# EAGLE design board_1 (EAGLE 6.1)

## Sheet 1 of 2
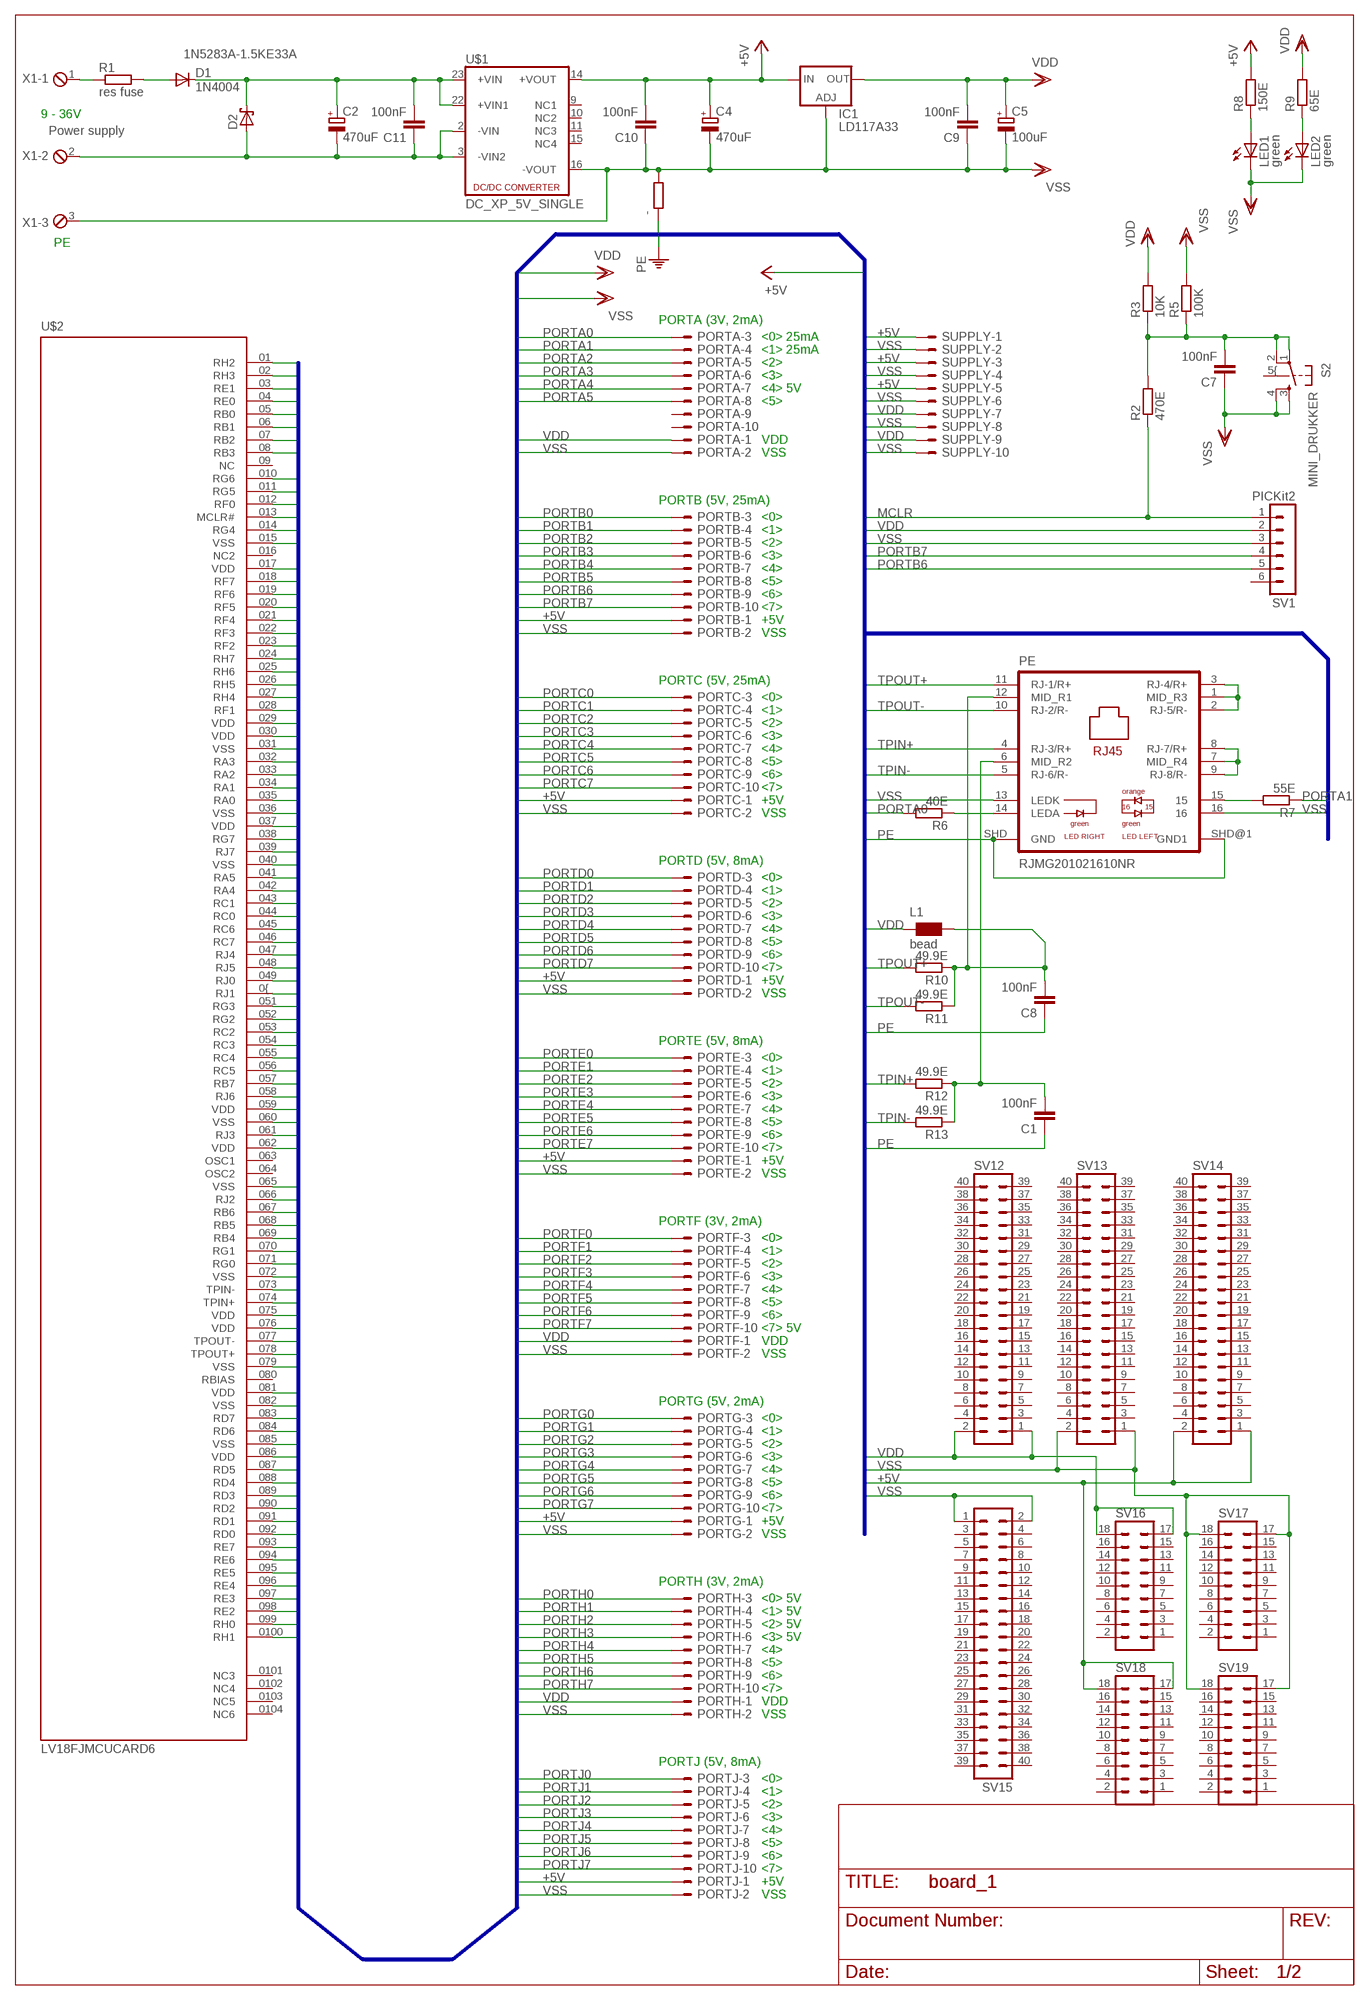
[diagram p0: schematic, sheet 1]

### Parts
-  R-EU_0204/2V  [0204V]
C1  100nF  C-EU050-025X075  [C050-025X075]
C2  470uF  CPOL-EUE5-8.5  [E5-8,5]
C4  470uF  CPOL-EUE5-8.5  [E5-8,5]
C5  100uF  CPOL-EUE5-8.5  [E5-8,5]
C7  100nF  C-EU050-025X075  [C050-025X075]
C8  100nF  C-EU050-025X075  [C050-025X075]
C9  100nF  C-EU050-025X075  [C050-025X075]
C10  100nF  C-EU050-025X075  [C050-025X075]
C11  100nF  C-EU050-025X075  [C050-025X075]
D1  1N4004  [DO41-10]
D2  1N5283A-1.5KE33A  TSD15  [CB429-15]
IC1  LD117A33  [TO220L1_2]
L1  bead  WE-MI_1206  [1206]
LED1  green  LED3MM  [LED3MM]
LED2  green  LED3MM  [LED3MM]
PE  RJMG201021610NR  [RJMG20102XX10XX]
PORTA  ML10E  [ML10]
PORTB  ML10E  [ML10]
PORTC  ML10E  [ML10]
PORTD  ML10E  [ML10]
PORTE  ML10E  [ML10]
PORTF  ML10E  [ML10]
PORTG  ML10E  [ML10]
PORTH  ML10E  [ML10]
PORTJ  ML10E  [ML10]
R1  res fuse  R-EU_0207/7  [0207/7]
R2  470E  R-EU_0207/10  [0207/10]
R3  10K  R-EU_0207/10  [0207/10]
R5  100K  R-EU_0207/10  [0207/10]
R6  40E  R-EU_0207/10  [0207/10]
R7  55E  R-EU_0207/10  [0207/10]
R8  150E  R-EU_0207/10  [0207/10]
R9  65E  R-EU_0207/10  [0207/10]
R10  49.9E  R-EU_0207/10  [0207/10]
R11  49.9E  R-EU_0207/10  [0207/10]
R12  49.9E  R-EU_0207/10  [0207/10]
R13  49.9E  R-EU_0207/10  [0207/10]
S2  MINI_DRUKKER  [MINI_DRUKKER]
SUPPLY  ML10E  [ML10]
SV1  PICKit2  MA06-1  [MA06-1]
SV12  MA20-2  [MA20-2]
SV13  MA20-2  [MA20-2]
SV14  MA20-2  [MA20-2]
SV15  MA20-2  [MA20-2]
SV16  MA09-2  [MA09-2]
SV17  MA09-2  [MA09-2]
SV18  MA09-2  [MA09-2]
SV19  MA09-2  [MA09-2]
U$1  DC_XP_5V_SINGLE  [XP_24P_DIP_5V_SINGLE]
U$2  LV18FJMCUCARD6  [LV18FJMCUCARD6]
X1  Power supply  MPT3  [3POL254]

### Nets
+5V [Power 5V +]: C4.+ C10.2 IC1.3(IN) PORTB.1 PORTC.1 PORTD.1 PORTE.1 PORTG.1 PORTJ.1 R8.2 SUPPLY.1 SUPPLY.3 SUPPLY.5 SV14.1 SV14.2 SV18.17 SV18.18 U$1.14(+VOUT)
MCLR: R2.1 SV1.1 U$2.013(MCLR#)
N$1 [High Voltage +]: D1.A R1.2
N$2: PE.1(MID_R3) PE.2(RJ-5/R-) PE.3(RJ-4/R+)
N$3 [High Voltage +]: R1.1 X1.1
N$4 [High Voltage +]: C2.+ C11.2 D1.C D2.C U$1.22(+VIN1) U$1.23(+VIN)
N$5: C7.2 R2.2 R3.1 R5.1 S2.1(P) S2.2(P1)
N$6: PE.7(MID_R4) PE.8(RJ-7/R+) PE.9(RJ-8/R-)
N$7 [High Voltage -]: C2.- C11.1 D2.A U$1.2(-VIN) U$1.3(-VIN2) X1.2
N$8: PE.14(LEDA) R6.1
N$9: PE.15 R7.2
N$12: LED1.A R8.1
N$13: LED2.A R9.1
N$14: C8.2 L1.2 PE.12(MID_R1) R10.1 R11.1
N$15: C1.2 PE.6(MID_R2) R12.1 R13.1
PE [High Voltage -]: -.1 C1.1 C8.1 PE.SHD(GND) PE.SHD@1(GND1)
PORTA0: PORTA.3 R6.2 U$2.035(RA0)
PORTA1: PORTA.4 R7.1 U$2.034(RA1)
PORTA2: PORTA.5 U$2.033(RA2)
PORTA3: PORTA.6 U$2.032(RA3)
PORTA4: PORTA.7 U$2.042(RA4)
PORTA5: PORTA.8 U$2.041(RA5)
PORTB0: PORTB.3 U$2.05(RB0)
PORTB1: PORTB.4 U$2.06(RB1)
PORTB2: PORTB.5 U$2.07(RB2)
PORTB3: PORTB.6 U$2.08(RB3)
PORTB4: PORTB.7 U$2.069(RB4)
PORTB5: PORTB.8 U$2.068(RB5)
PORTB6: PORTB.9 SV1.5 U$2.067(RB6)
PORTB7: PORTB.10 SV1.4 U$2.057(RB7)
PORTC0: PORTC.3 U$2.044(RC0)
PORTC1: PORTC.4 U$2.043(RC1)
PORTC2: PORTC.5 U$2.053(RC2)
PORTC3: PORTC.6 U$2.054(RC3)
PORTC4: PORTC.7 U$2.055(RC4)
PORTC5: PORTC.8 U$2.056(RC5)
PORTC6: PORTC.9 U$2.045(RC6)
PORTC7: PORTC.10 U$2.046(RC7)
PORTD0: PORTD.3 U$2.092(RD0)
PORTD1: PORTD.4 U$2.091(RD1)
PORTD2: PORTD.5 U$2.090(RD2)
PORTD3: PORTD.6 U$2.089(RD3)
PORTD4: PORTD.7 U$2.088(RD4)
PORTD5: PORTD.8 U$2.087(RD5)
PORTD6: PORTD.9 U$2.084(RD6)
PORTD7: PORTD.10 U$2.083(RD7)
PORTE0: PORTE.3 U$2.04(RE0)
PORTE1: PORTE.4 U$2.03(RE1)
PORTE2: PORTE.5 U$2.098(RE2)
PORTE3: PORTE.6 U$2.097(RE3)
PORTE4: PORTE.7 U$2.096(RE4)
PORTE5: PORTE.8 U$2.095(RE5)
PORTE6: PORTE.9 U$2.094(RE6)
PORTE7: PORTE.10 U$2.093(RE7)
PORTF0: PORTF.3 U$2.012(RF0)
PORTF1: PORTF.4 U$2.028(RF1)
PORTF2: PORTF.5 U$2.023(RF2)
PORTF3: PORTF.6 U$2.022(RF3)
PORTF4: PORTF.7 U$2.021(RF4)
PORTF5: PORTF.8 U$2.020(RF5)
PORTF6: PORTF.9 U$2.019(RF6)
PORTF7: PORTF.10 U$2.018(RF7)
PORTG0: PORTG.3 U$2.071(RG0)
PORTG1: PORTG.4 U$2.070(RG1)
PORTG2: PORTG.5 U$2.052(RG2)
PORTG3: PORTG.6 U$2.051(RG3)
PORTG4: PORTG.7 U$2.014(RG4)
PORTG5: PORTG.8 U$2.011(RG5)
PORTG6: PORTG.9 U$2.010(RG6)
PORTG7: PORTG.10 U$2.038(RG7)
PORTH0: PORTH.3 U$2.099(RH0)
PORTH1: PORTH.4 U$2.0100(RH1)
PORTH2: PORTH.5 U$2.01(RH2)
PORTH3: PORTH.6 U$2.02(RH3)
PORTH4: PORTH.7 U$2.027(RH4)
PORTH5: PORTH.8 U$2.026(RH5)
PORTH6: PORTH.9 U$2.025(RH6)
PORTH7: PORTH.10 U$2.024(RH7)
PORTJ0: PORTJ.3 U$2.049(RJ0)
PORTJ1: PORTJ.4 U$2.0{(RJ1)
PORTJ2: PORTJ.5 U$2.066(RJ2)
PORTJ3: PORTJ.6 U$2.061(RJ3)
PORTJ4: PORTJ.7 U$2.047(RJ4)
PORTJ5: PORTJ.8 U$2.048(RJ5)
PORTJ6: PORTJ.9 U$2.058(RJ6)
PORTJ7: PORTJ.10 U$2.039(RJ7)
TPIN+: PE.4(RJ-3/R+) R12.2 U$2.074(TPIN+)
TPIN-: PE.5(RJ-6/R-) R13.2 U$2.073(TPIN-)
TPOUT+: PE.11(RJ-1/R+) R10.2 U$2.078(TPOUT+)
TPOUT-: PE.10(RJ-2/R-) R11.2 U$2.077(TPOUT-)
VDD [Power 3V +]: C5.+ C9.2 IC1.2(OUT) L1.1 PORTA.1 PORTF.1 PORTH.1 R3.2 R9.2 SUPPLY.7 SUPPLY.9 SV1.2 SV12.1 SV12.2 SV16.17 SV16.18 U$2.017(VDD) U$2.029(VDD) U$2.030(VDD) U$2.037(VDD) U$2.059(VDD) U$2.062(VDD) U$2.075(VDD) U$2.076(VDD) U$2.081(VDD) U$2.086(VDD)
VSS [Power 0V]: -.2 C4.- C5.- C7.1 C9.1 C10.1 IC1.1(ADJ) LED1.K(C) LED2.K(C) PE.13(LEDK) PE.16 PORTA.2 PORTB.2 PORTC.2 PORTD.2 PORTE.2 PORTF.2 PORTG.2 PORTH.2 PORTJ.2 R5.2 S2.3(S) S2.4(S1) SUPPLY.2 SUPPLY.4 SUPPLY.6 SUPPLY.8 SUPPLY.10 SV1.3 SV13.1 SV13.2 SV15.1 SV15.2 SV17.17 SV17.18 SV19.17 SV19.18 U$1.16(-VOUT) U$2.015(VSS) U$2.031(VSS) U$2.036(VSS) U$2.040(VSS) U$2.060(VSS) U$2.065(VSS) U$2.072(VSS) U$2.079(VSS) U$2.082(VSS) U$2.085(VSS) X1.3
Unconnected: PORTA.9 PORTA.10 S2.5{(SHLD) SV1.6 SV12.3 SV12.4 SV12.5 SV12.6 SV12.7 SV12.8 SV12.9 SV12.10 SV12.11 SV12.12 SV12.13 SV12.14 SV12.15 SV12.16 SV12.17 SV12.18 SV12.19 SV12.20 SV12.21 SV12.22 SV12.23 SV12.24 SV12.25 SV12.26 SV12.27 SV12.28 SV12.29 SV12.30 SV12.31 SV12.32 SV12.33 SV12.34 SV12.35 SV12.36 SV12.37 SV12.38 SV12.39 SV12.40 SV13.3 SV13.4 SV13.5 SV13.6 SV13.7 SV13.8 SV13.9 SV13.10 SV13.11 SV13.12 SV13.13 SV13.14 SV13.15 SV13.16 SV13.17 SV13.18 SV13.19 SV13.20 SV13.21 SV13.22 SV13.23 SV13.24 SV13.25 SV13.26 SV13.27 SV13.28 SV13.29 SV13.30 SV13.31 SV13.32 SV13.33 SV13.34 SV13.35 SV13.36 SV13.37 SV13.38 SV13.39 SV13.40 SV14.3 SV14.4 SV14.5 SV14.6 SV14.7 SV14.8 SV14.9 SV14.10 SV14.11 SV14.12 SV14.13 SV14.14 SV14.15 SV14.16 SV14.17 SV14.18 SV14.19 SV14.20 SV14.21 SV14.22 SV14.23 SV14.24 SV14.25 SV14.26 SV14.27 SV14.28 SV14.29 SV14.30 SV14.31 SV14.32 SV14.33 SV14.34 SV14.35 SV14.36 SV14.37 SV14.38 SV14.39 SV14.40 SV15.3 SV15.4 SV15.5 SV15.6 SV15.7 SV15.8 SV15.9 SV15.10 SV15.11 SV15.12 SV15.13 SV15.14 SV15.15 SV15.16 SV15.17 SV15.18 SV15.19 SV15.20 SV15.21 SV15.22 SV15.23 SV15.24 SV15.25 SV15.26 SV15.27 SV15.28 SV15.29 SV15.30 SV15.31 SV15.32 SV15.33 SV15.34 SV15.35 SV15.36 SV15.37 SV15.38 SV15.39 SV15.40 SV16.1 SV16.2 SV16.3 SV16.4 SV16.5 SV16.6 SV16.7 SV16.8 SV16.9 SV16.10 SV16.11 SV16.12 SV16.13 SV16.14 SV16.15 SV16.16 SV17.1 SV17.2 SV17.3 SV17.4 SV17.5 SV17.6 SV17.7 SV17.8 SV17.9 SV17.10 SV17.11 SV17.12 SV17.13 SV17.14 SV17.15 SV17.16 SV18.1 SV18.2 SV18.3 SV18.4 SV18.5 SV18.6 SV18.7 SV18.8 SV18.9 SV18.10 SV18.11 SV18.12 SV18.13 SV18.14 SV18.15 SV18.16 SV19.1 SV19.2 SV19.3 SV19.4 SV19.5 SV19.6 SV19.7 SV19.8 SV19.9 SV19.10 SV19.11 SV19.12 SV19.13 SV19.14 SV19.15 SV19.16 U$1.9(NC1) U$1.10(NC2) U$1.11(NC3) U$1.15(NC4) U$2.09(NC) U$2.016(NC2) U$2.063(OSC1) U$2.064(OSC2) U$2.080(RBIAS) U$2.0101(NC3) U$2.0102(NC4) U$2.0103(NC5) U$2.0104(NC6)

### Buses
PORTA[0..7],PORTB[0..7],PORTC[0..7],PORTD[0..7],PORTE[0..7],PORTF[0..7],PORTG[0..7],PORTH[0..7],PORTJ[0..7],TPIN+,TPIN-,TPOUT-,TPOUT+,VDD,VSS,MCLR,+5V,PE

### Notes on the sheet
- 9 - 36V
- PE
- PORTA (3V, 2mA)
- <0> 25mA
- <1> 25mA
- <2>
- <3>
- <4> 5V
- <5>
- VDD
- VSS
- PORTB (5V, 25mA)
- <0>
- <1>
- <2>
- <3>
- <4>
- <5>
- <6>
- <7>
- +5V
- VSS
- PORTC (5V, 25mA)
- <0>
- <1>
- <2>
- <3>
- <4>
- <5>
- <6>
- <7>
- +5V
- VSS
- PORTD (5V, 8mA)
- <0>
- <1>
- <2>
- <3>
- <4>
- <5>
- <6>
- <7>
- +5V
- VSS
- PORTE (5V, 8mA)
- <0>
- <1>
- <2>
- <3>
- <4>
- <5>
- <6>
- <7>
- +5V
- VSS
- PORTF (3V, 2mA)
- <0>
- <1>
- <2>
- <3>
- <4>
- <5>
- <6>
- <7> 5V
- VDD
- VSS
- PORTG (5V, 2mA)
- <0>
- <1>
- <2>
- <3>
- <4>
- <5>
- <6>
- <7>
- +5V
- VSS
- PORTH (3V, 2mA)
- <0> 5V
- <1> 5V
- <2> 5V
- <3> 5V
- <4>
- <5>
- <6>
- <7>
- VDD
- VSS
- PORTJ (5V, 8mA)
- <0>
- <1>
- <2>
- <3>
- <4>
- <5>
- <6>
- <7>
- +5V
- VSS

## Sheet 2 of 2
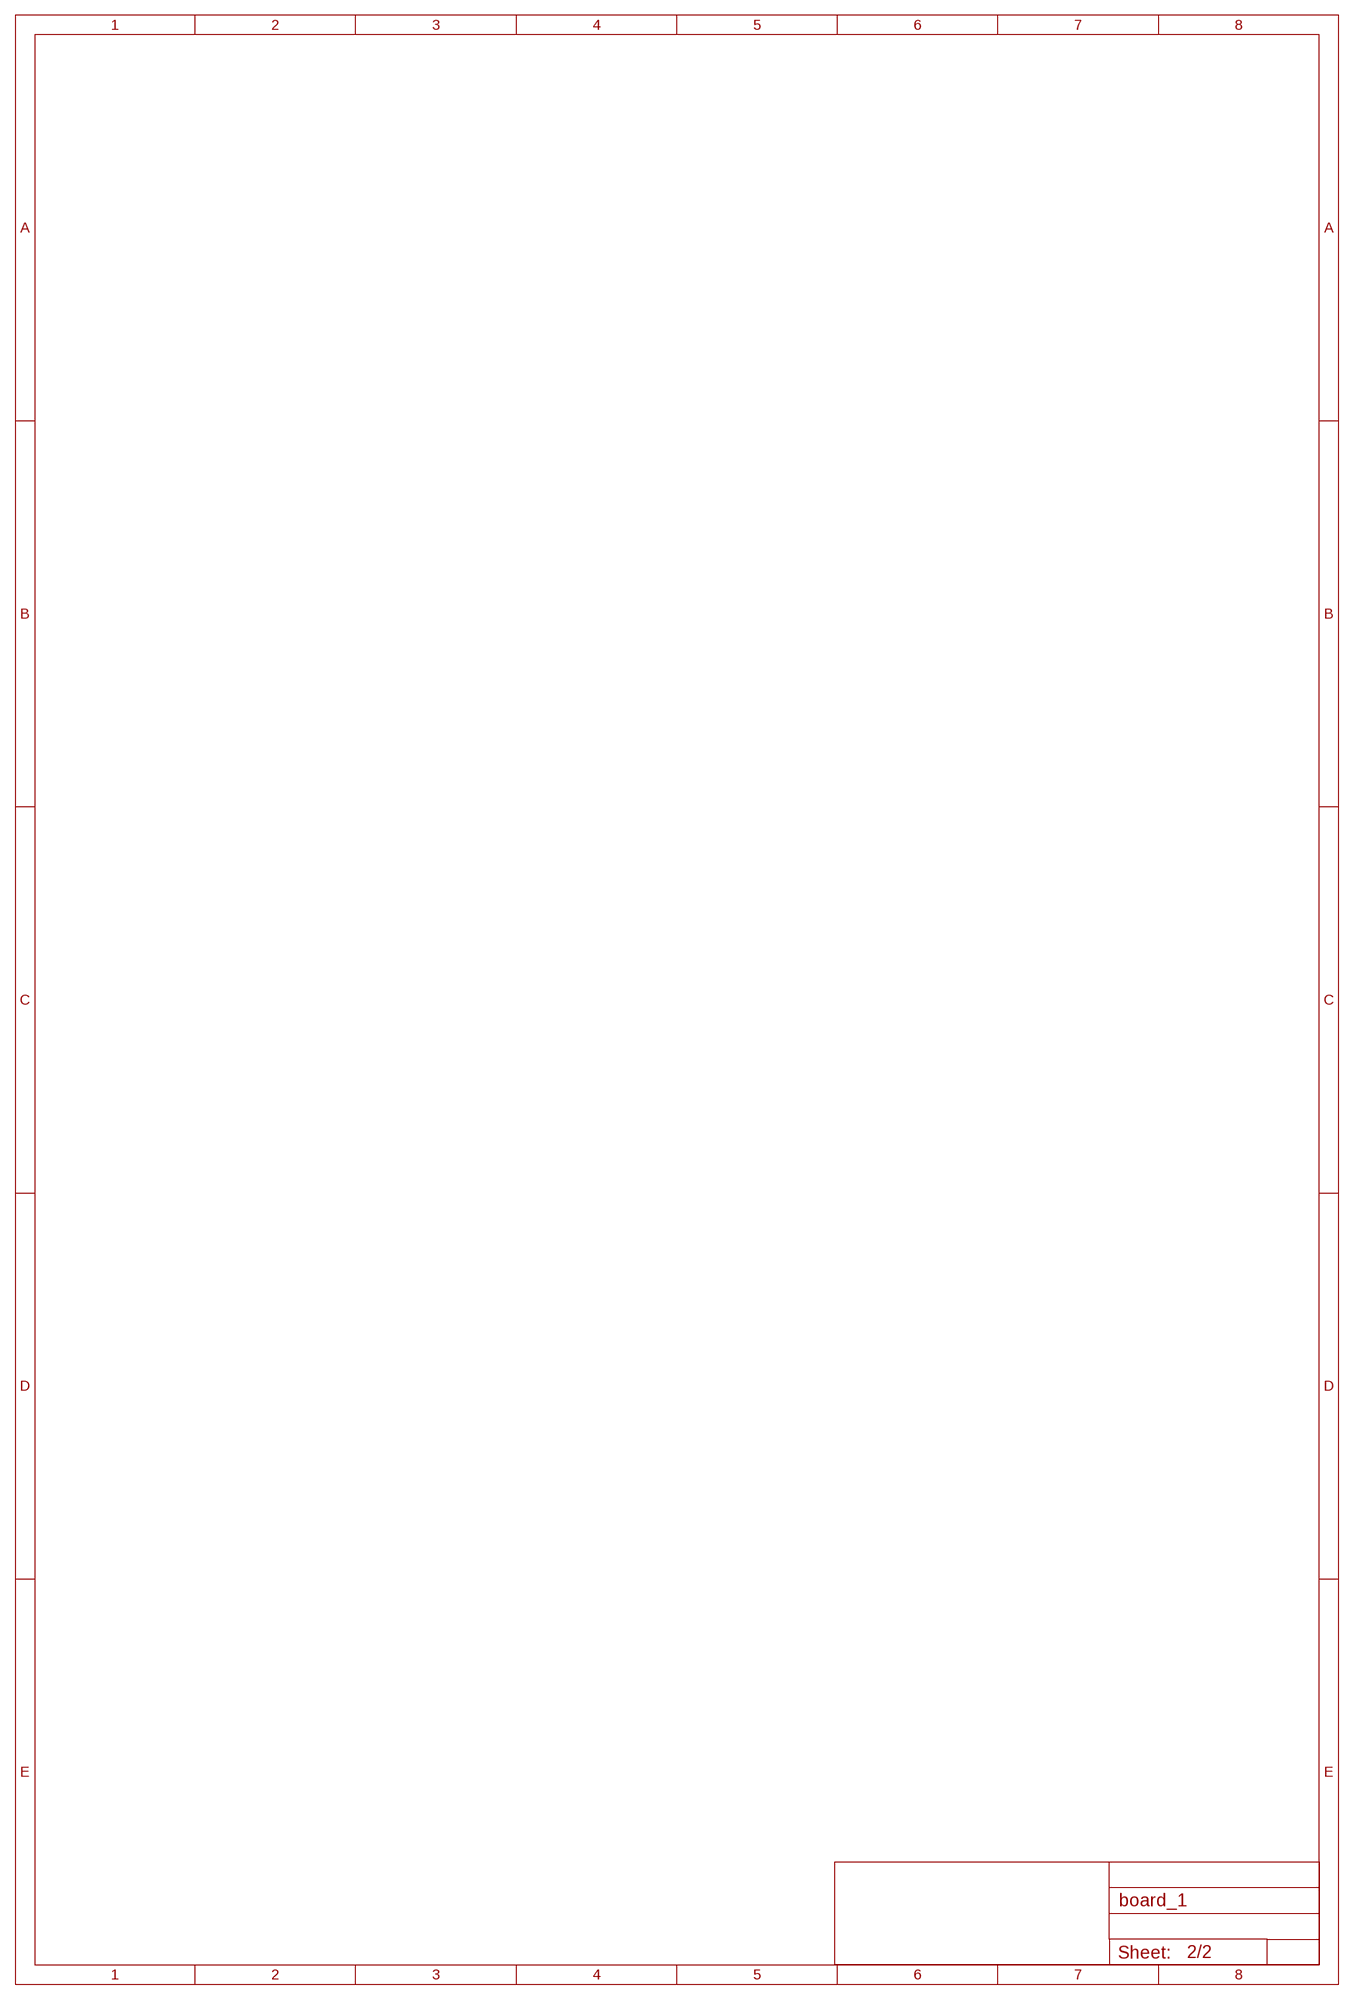
[diagram p1: schematic, sheet 2]

## Library data of the parts
- R1-R3 R5-R13 = rcl:R-EU_: RESISTOR, European symbol
C1 C7-C11 = rcl:C-EU: CAPACITOR, European symbol
C2 C4 C5 = rcl:CPOL-EU: POLARIZED CAPACITOR, European symbol
D1 = diode:1N4004: DIODE general purpose rectifier, 1 A
D2 = diode:TSD15: DIODE
IC1 = v-reg:LD117A?*: Low drop fixed and adjustable positive voltage regulators 1 A Source: http://www.st.com/stonline/products/literature/ds/7194/ld1117axx.pdf
L1 = wuerth-elektronik:WE-MI: SMD Multilayer Inductor WE-MI - Excellent solderability and high heat resistance -- Filter switches -- Oscillators -- Adjustment networks -- Discretely built T- or Pi-Filter
LED1 LED2 = led:LED: LED OSRAM: - CHIPLED LG R971, LG N971, LY N971, LG Q971, LY Q971, LO R971, LY R971 LH N974, LH R974 LS Q976, LO Q976, LY Q976 LO Q996 - Hyper CHIPLED LW Q18S LB Q993, LB Q99A, LB R99A - SideLED LS A670, LO A670, LY A670, LG A670, LP A670 LB A673, LV A673, LT A673, LW A673 LH A674 LY A675 LS A676, LA A676, LO A676, LY A676, LW A676 LS A679, LY A679, LG A679 - Hyper Micro SIDELED® LS Y876, LA Y876, LO Y876, LY Y876 LT Y87S - SmartLED LW L88C, LW L88S LB L89C, LB L89S, LG L890 LS L89K, LO L89K, LY L89K LS L896, LA L896, LO L896, LY L896 - TOPLED LS T670, LO T670, LY T670, LG T670, LP T670 LSG T670, LSP T670, LSY T670, LOP T670, LYG T670 LG T671, LOG T671, LSG T671 LB T673, LV T673, LT T673, LW T673 LH T674 LS T676, LA T676, LO T676, LY T676, LB T676, LH T676, LSB T676, LW T676 LB T67C, LV T67C, LT T67C, LS T67K, LO T67K, LY T67K, LW E67C LS E67B, LA E67B, LO E67B, LY E67B, LB E67C, LV E67C, LT E67C LW T67C LS T679, LY T679, LG T679 LS T770, LO T770, LY T770, LG T770, LP T770 LB T773, LV T773, LT T773, LW T773 LH T774 LS E675, LA E675, LY E675, LS T675 LS T776, LA T776, LO T776, LY T776, LB T776 LHGB T686 LT T68C, LB T68C - Hyper Mini TOPLED® LB M676 - Mini TOPLED Santana® LG M470 LS M47K, LO M47K, LY M47K Source: http://www.osram.convergy.de LUXEON: - LUMILED® LXK2-PW12-R00, LXK2-PW12-S00, LXK2-PW14-U00, LXK2-PW14-V00 LXK2-PM12-R00, LXK2-PM12-S00, LXK2-PM14-U00 LXK2-PE12-Q00, LXK2-PE12-R00, LXK2-PE12-S00, LXK2-PE14-T00, LXK2-PE14-U00 LXK2-PB12-K00, LXK2-PB12-L00, LXK2-PB12-M00, LXK2-PB14-N00, LXK2-PB14-P00, LXK2-PB14-Q00 LXK2-PR12-L00, LXK2-PR12-M00, LXK2-PR14-Q00, LXK2-PR14-R00 LXK2-PD12-Q00, LXK2-PD12-R00, LXK2-PD12-S00 LXK2-PH12-R00, LXK2-PH12-S00 LXK2-PL12-P00, LXK2-PL12-Q00, LXK2-PL12-R00 Source: www.luxeon.com KINGBRIGHT: KA-3528ASYC Source: www.kingbright.com
PE = Custom components:RJMG201021610NR
PORTA PORTB PORTC PORTD PORTE PORTF PORTG PORTH PORTJ SUPPLY = con-ml:ML10E: HARTING
S2 = Custom components:MINI_DRUKKER
SV1 = con-lstb:MA06-1: PIN HEADER
SV12-SV15 = con-lstb:MA20-2: PIN HEADER
SV16-SV19 = con-lstb:MA09-2: PIN HEADER
U$1 = dc-dc-converter:DC_XP_5V_SINGLE
U$2 = Mikroe:LV18FJMCUCARD6
X1 = con-phoenix-254:MPT3: PHOENIX CONNECTOR

## Net classes
1 Power 5V +: width 0.813 mm, drill 0.381 mm, clearance 0.406 mm
2 High Voltage +: width 0.813 mm, drill 0.635 mm, clearance 0.406 mm
3 Digital: width 0.254 mm, drill 0.508 mm, clearance 0.406 mm
4 Power 0V: width 0.813 mm, drill 0.381 mm, clearance 0.406 mm
5 High Voltage -: width 0.813 mm, drill 0.635 mm, clearance 0.406 mm
6 Power 3V +: width 0.813 mm, drill 0.61 mm, clearance 0.406 mm

## Board
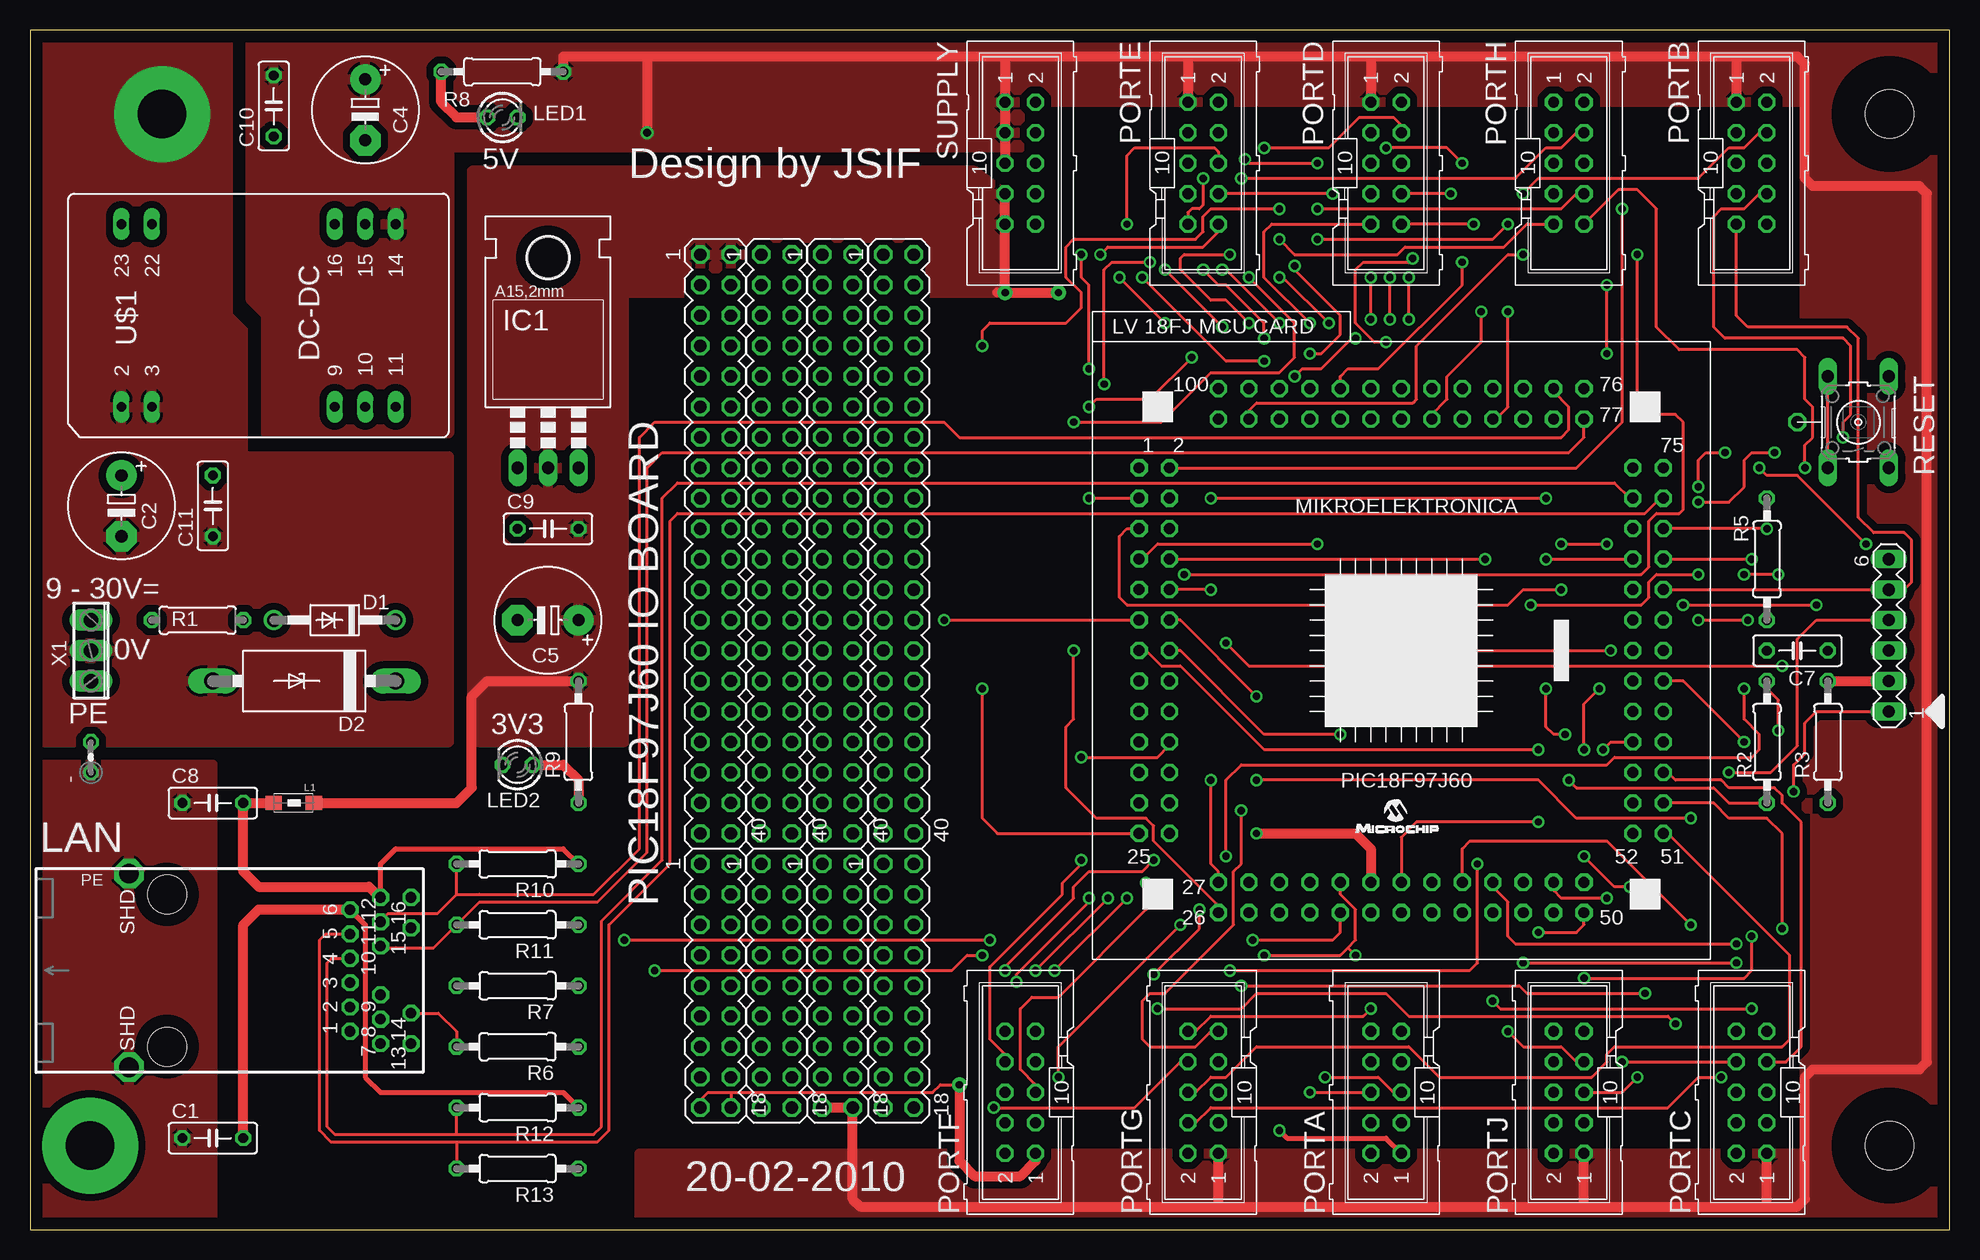
[diagram p2: board, top side]
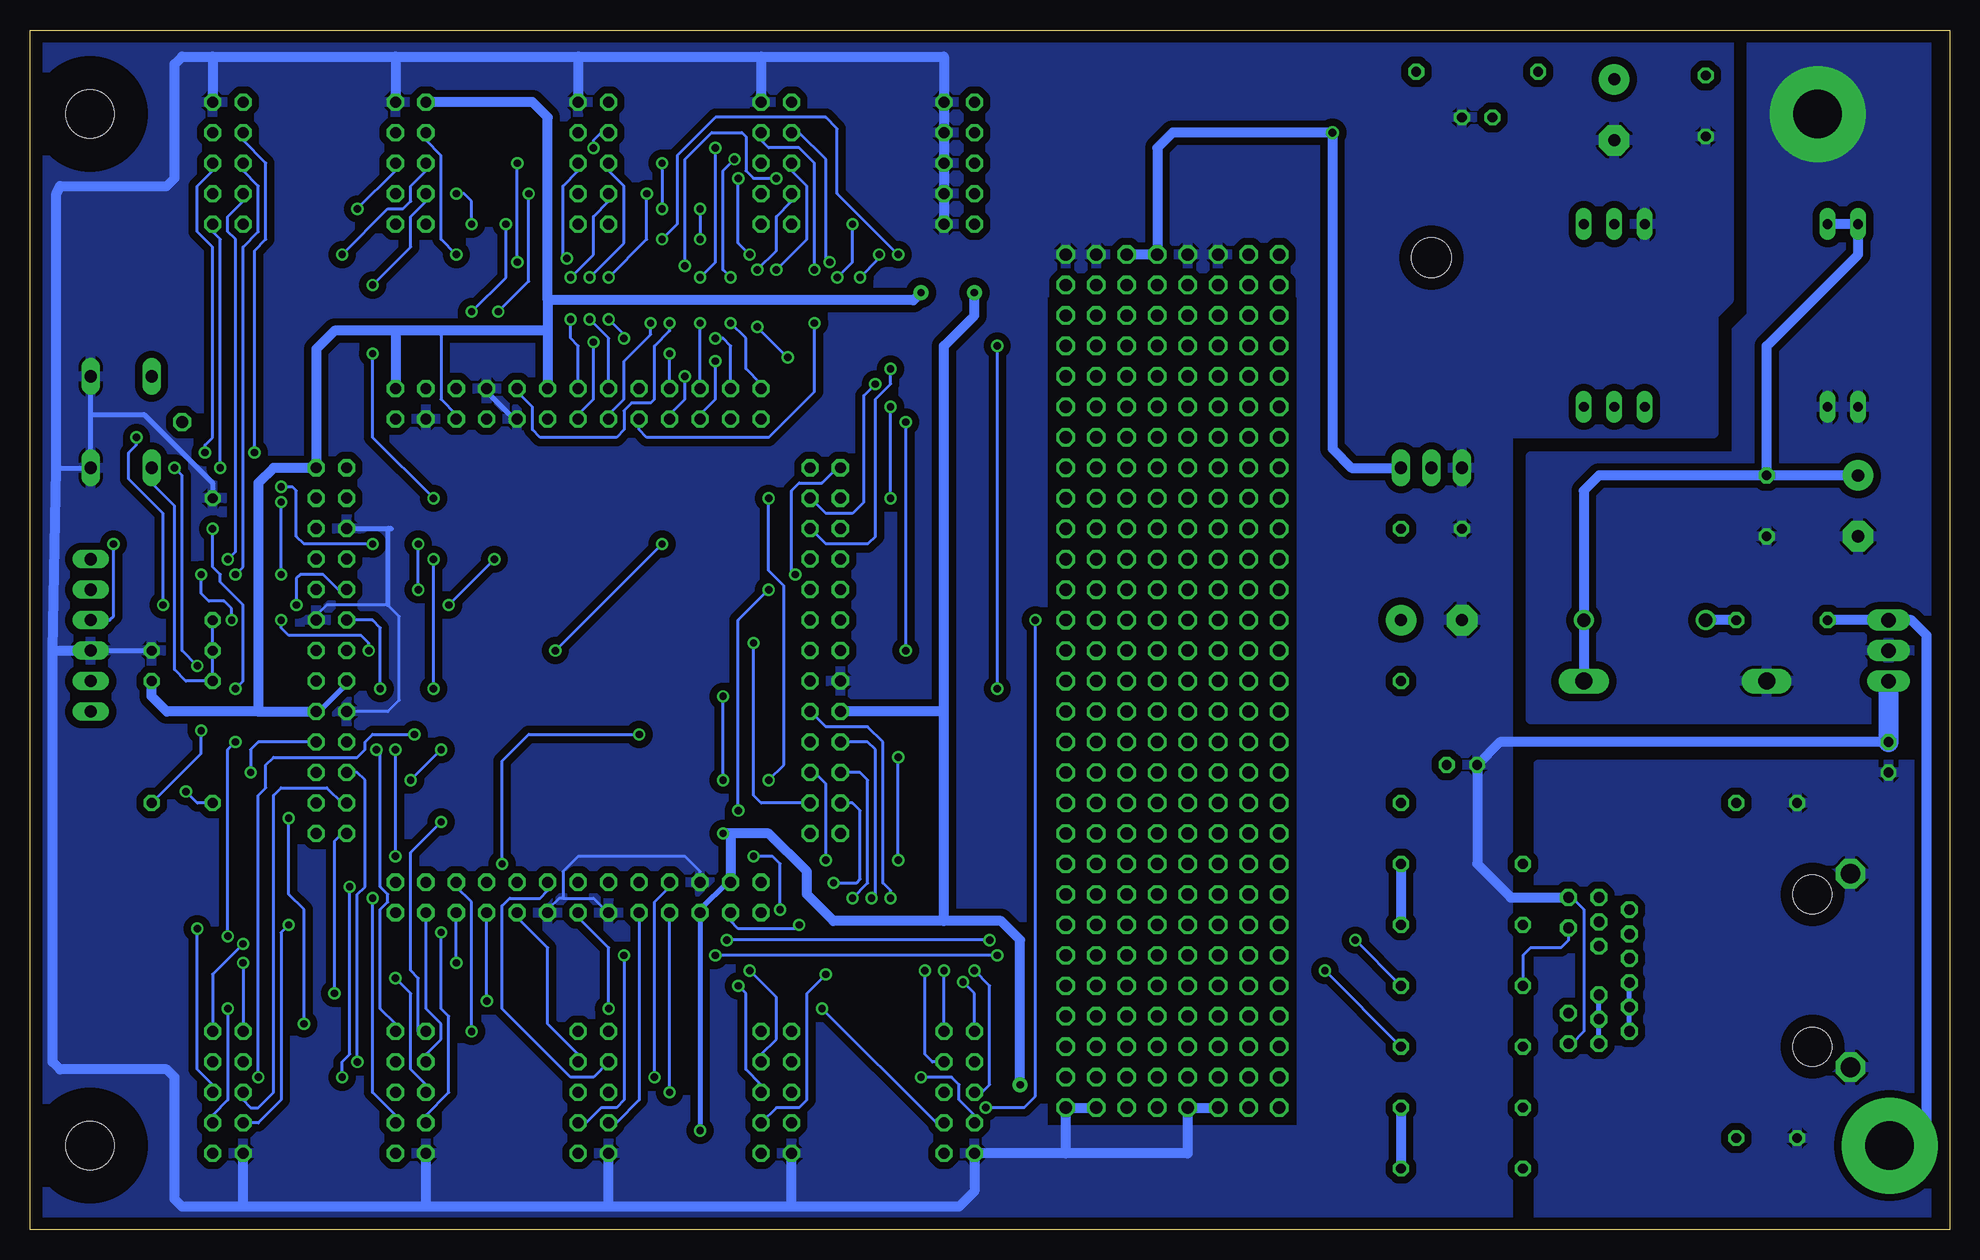
[diagram p3: board, bottom side, seen from below]

Size 160 x 100 mm. Coordinates in mm from the lower left corner, seen from the top.
Outline: 0,0 160,0 160,100 0,100 0,0
Copper layers (1*16): Top 0.035mm / dielectric 1.5mm / Bottom 0.035mm
Design rules: minimum track width 10mil, minimum drill 24mil, track to track 8mil, track to pad 8mil, pad to pad 8mil, via to via 8mil, smd to smd 8mil, copper to edge 40mil, drill to drill 8mil, minimum pad ring 10mil, minimum via ring 8mil, stop-mask expansion 4mil, vias tented up to drill 0mil, thermal gap 10mil
Holes 4.06 mm at 155,93 155,7
tRestrict: area 151,89 to 159,97; area 151,3 to 159,11
bRestrict: area 151,89 to 159,97; area 151,3 to 159,11

### Footprints (pad centres in the part's own frame; a part is rotated, then mirrored left to right if it is on the bottom)
0204V = drill 0.813 octagon: 1 -1.27,0; 2 1.27,0
C050-025X075 = drill 0.813 octagon: 1 -2.54,0; 2 2.54,0
E5-8,5 = drill 1.016 pad 2.54: + -2.54,0 | drill 1.016 pad 2.54 octagon: - 2.54,0
DO41-10 = drill 1.118: A 5.08,0; C -5.08,0
CB429-15 = drill 1.397 long: A 7.62,0; C -7.62,0
TO220L1_2 = drill 1.016 long: 1 -2.54,-6.35; 2 0,-6.35; 3 2.54,-6.35 | hole 3.302: 0,11.176
1206 = smd 1.35 x 1.2: 1 -1.7,0; 2 1.65,0
LED3MM = drill 0.813 octagon: A -1.27,0; K 1.27,0
RJMG20102XX10XX = drill 0.89 octagon: 1 -5.075,-15.25; 2 -3.045,-15.25; 3 -1.015,-15.25; 4 1.015,-15.25; 5 3.045,-15.25; 6 5.075,-15.25; 7 -6.09,-17.79; 8 -4.06,-17.79; 9 -2.03,-17.79; 10 2.03,-17.79; 11 4.06,-17.79; 12 6.09,-17.79; 13 -6.09,-20.33; 14 -3.55,-20.33; 15 3.55,-20.33; 16 6.09,-20.33 | drill 1.64 octagon: SHD -8.065,3.17; SHD@1 8.065,3.17 | hole 3.25: -6.35,0; 6.35,0
ML10 = drill 0.914 octagon: 1 -5.08,-1.27; 2 -5.08,1.27; 3 -2.54,-1.27; 4 -2.54,1.27; 5 0,-1.27; 6 0,1.27; 7 2.54,-1.27; 8 2.54,1.27; 9 5.08,-1.27; 10 5.08,1.27
0207/7 = drill 0.813 octagon: 1 -3.81,0; 2 3.81,0
0207/10 = drill 0.813 octagon: 1 -5.08,0; 2 5.08,0
MINI_DRUKKER = drill 1.016 long: 1 -3.81,2.54; 2 3.81,2.54; 3 -3.81,-2.54; 4 3.81,-2.54 | drill 1.016 octagon: 5{ 0,5.08
MA06-1 = drill 1.016 long: 1 -6.35,0; 2 -3.81,0; 3 -1.27,0; 4 1.27,0; 5 3.81,0; 6 6.35,0
MA20-2 = drill 1.016 octagon: 1 -24.13,-1.27; 2 -24.13,1.27; 3 -21.59,-1.27; 4 -21.59,1.27; 5 -19.05,-1.27; 6 -19.05,1.27; 7 -16.51,-1.27; 8 -16.51,1.27; 9 -13.97,-1.27; 10 -13.97,1.27; 11 -11.43,-1.27; 12 -11.43,1.27; 13 -8.89,-1.27; 14 -8.89,1.27; 15 -6.35,-1.27; 16 -6.35,1.27; 17 -3.81,-1.27; 18 -3.81,1.27; 19 -1.27,-1.27; 20 -1.27,1.27; 21 1.27,-1.27; 22 1.27,1.27; 23 3.81,-1.27; 24 3.81,1.27; 25 6.35,-1.27; 26 6.35,1.27; 27 8.89,-1.27; 28 8.89,1.27; 29 11.43,-1.27; 30 11.43,1.27; 31 13.97,-1.27; 32 13.97,1.27; 33 16.51,-1.27; 34 16.51,1.27; 35 19.05,-1.27; 36 19.05,1.27; 37 21.59,-1.27; 38 21.59,1.27; 39 24.13,-1.27; 40 24.13,1.27
MA09-2 = drill 1.016 octagon: 1 -10.16,-1.27; 2 -10.16,1.27; 3 -7.62,-1.27; 4 -7.62,1.27; 5 -5.08,-1.27; 6 -5.08,1.27; 7 -2.54,-1.27; 8 -2.54,1.27; 9 0,-1.27; 10 0,1.27; 11 2.54,-1.27; 12 2.54,1.27; 13 5.08,-1.27; 14 5.08,1.27; 15 7.62,-1.27; 16 7.62,1.27; 17 10.16,-1.27; 18 10.16,1.27
XP_24P_DIP_5V_SINGLE = drill 0.813 long: 2 -7.62,11.43; 3 -7.62,8.89; 9 -7.62,-6.35; 10 -7.62,-8.89; 11 -7.62,-11.43; 14 7.62,-11.43; 15 7.62,-8.89; 16 7.62,-6.35; 22 7.62,8.89; 23 7.62,11.43
LV18FJMCUCARD6 = drill 0.914 octagon: 0{ 15.24,-21.844; 01 -21.844,15.24; 02 -19.304,15.24; 03 -21.844,12.7; 04 -19.304,12.7; 05 -21.844,10.16; 06 -19.304,10.16; 07 -21.844,7.62; 08 -19.304,7.62; 09 -21.844,5.08; 010 -19.304,5.08; 011 -21.844,2.54; 012 -19.304,2.54; 013 -21.844,0; 014 -19.304,0; 015 -21.844,-2.54; 016 -19.304,-2.54; 017 -21.844,-5.08; 018 -19.304,-5.08; 019 -21.844,-7.62; 020 -19.304,-7.62; 021 -21.844,-10.16; 022 -19.304,-10.16; 023 -21.844,-12.7; 024 -19.304,-12.7; 025 -21.844,-15.24; 026 -15.24,-21.844; 027 -15.24,-19.304; 028 -12.7,-21.844; 029 -12.7,-19.304; 030 -10.16,-21.844; 031 -10.16,-19.304; 032 -7.62,-21.844; 033 -7.62,-19.304; 034 -5.08,-21.844; 035 -5.08,-19.304; 036 -2.54,-21.844; 037 -2.54,-19.304; 038 0,-21.844; 039 0,-19.304; 040 2.54,-21.844; 041 2.54,-19.304; 042 5.08,-21.844; 043 5.08,-19.304; 044 7.62,-21.844; 045 7.62,-19.304; 046 10.16,-21.844; 047 10.16,-19.304; 048 12.7,-21.844; 049 12.7,-19.304; 051 21.844,-15.24; 052 19.304,-15.24; 053 21.844,-12.7; 054 19.304,-12.7; 055 21.844,-10.16; 056 19.304,-10.16; 057 21.844,-7.62; 058 19.304,-7.62; 059 21.844,-5.08; 060 19.304,-5.08; 061 21.844,-2.54; 062 19.304,-2.54; 063 21.844,0; 064 19.304,0; 065 21.844,2.54; 066 19.304,2.54; 067 21.844,5.08; 068 19.304,5.08; 069 21.844,7.62; 070 19.304,7.62; 071 21.844,10.16; 072 19.304,10.16; 073 21.844,12.7; 074 19.304,12.7; 075 21.844,15.24; 076 15.24,21.844; 077 15.24,19.304; 078 12.7,21.844; 079 12.7,19.304; 080 10.16,21.844; 081 10.16,19.304; 082 7.62,21.844; 083 7.62,19.304; 084 5.08,21.844; 085 5.08,19.304; 086 2.54,21.844; 087 2.54,19.304; 088 0,21.844; 089 0,19.304; 090 -2.54,21.844; 091 -2.54,19.304; 092 -5.08,21.844; 093 -5.08,19.304; 094 -7.62,21.844; 095 -7.62,19.304; 096 -10.16,21.844; 097 -10.16,19.304; 098 -12.7,21.844; 099 -12.7,19.304; 0100 -15.24,21.844; 0101 -19.304,-15.24; 0102 15.24,-19.304; 0103 19.304,15.24; 0104 -15.24,19.304
3POL254 = drill 1.2 long: 1 -2.54,0; 2 0,0; 3 2.54,0

### Placement (x,y rotation side)
-  5.08,39.37 90 top
C1  15.24,7.62 0 top
C2  7.62,60.33 270 top
C4  27.94,93.34 270 top
C5  43.18,50.8 180 top
C7  147.32,48.26 180 top
C8  15.24,35.56 0 top
C9  43.18,58.42 0 top
C10  20.32,93.66 90 top
C11  15.24,60.33 90 top
D1  25.4,50.8 180 top
D2  22.86,45.72 180 top
IC1  43.18,69.85 0 top
L1  21.97,35.56 180 top
LED1  39.37,92.71 0 top
LED2  40.64,38.73 180 top
PE  11.43,21.59 90 top
PORTA  113.03,11.43 90 top
PORTB  143.51,88.9 270 top
PORTC  143.51,11.43 90 top
PORTD  113.03,88.9 270 top
PORTE  97.79,88.9 270 top
PORTF  82.55,11.43 90 top
PORTG  97.79,11.43 90 top
PORTH  128.27,88.9 270 top
PORTJ  128.27,11.43 90 top
R1  13.97,50.8 0 top
R2  144.78,40.64 90 top
R3  149.86,40.64 90 top
R5  144.78,55.88 90 top
R6  40.64,15.24 0 top
R7  40.64,20.32 180 top
R8  39.37,96.52 0 top
R9  45.72,40.64 90 top
R10  40.64,30.48 180 top
R11  40.64,25.4 180 top
R12  40.64,10.16 180 top
R13  40.64,5.08 180 top
S2  152.4,67.31 90 top
SUPPLY  82.55,88.9 270 top
SV1  154.94,49.53 90 top
SV12  57.15,57.15 270 top
SV13  62.23,57.15 270 top
SV14  67.31,57.15 270 top
SV15  72.39,57.15 270 top
SV16  57.15,20.32 270 top
SV17  62.23,20.32 270 top
SV18  67.31,20.32 270 top
SV19  72.39,20.32 270 top
U$1  19.05,76.2 90 top
U$2  114.3,48.26 0 top
X1  5.08,48.26 270 top

### Tracks (layer width: path | path; a pad name or v marks a point on that pad's centre or on a via)
+5V  (via drill 0.7)
  Top 0.813: 81.28,97.79 51.44,97.79 | 51.44,97.79 44.45,97.79 R8.2 | SUPPLY.5 SUPPLY.3 SUPPLY.1 81.28,97.79 | 96.52,97.79 PORTE.1 | 96.52,97.79 81.28,97.79 | 111.76,97.79 PORTD.1 | 111.76,97.79 96.52,97.79 | 142.24,97.79 111.76,97.79 | 144.78,1.91 147.32,1.91 147.96,2.54 147.96,12.7 148.59,13.34 157.48,13.34 158.12,13.97 158.12,86.36 157.48,87 148.59,87 147.96,87.63 147.96,97.16 147.32,97.79 142.24,97.79 | 144.78,1.91 PORTC.1 | 142.24,97.79 PORTB.1 | 129.54,1.91 PORTJ.1 | 129.54,1.91 144.78,1.91 | 99.06,1.91 PORTG.1 | 99.06,1.91 129.54,1.91 | 51.44,97.79 v51.44,91.44 | SV18.17 SV18.18 68.58,2.54 69.22,1.91 99.06,1.91
  Bottom 0.813: IC1.3 49.85,63.5 51.44,65.09 v51.44,91.44 64.77,91.44 66.04,90.17 SV14.1 SV14.2
  pour Top (isolate 0.61): 18.41,99.69 83.82,99.69 83.82,95.25 82.55,95.25 82.55,90.17 34.92,90.17 34.92,66.36 19.68,66.36 19.68,76.2 18.41,77.47
  pour Top (isolate 0.61): 159.38,99.69 159.38,0.64 50.8,0.64 50.8,6.35 147.96,6.35 147.96,93.98 83.82,93.98 83.82,99.69
MCLR  (via drill 0.61)
  Top 0.254: v125.73,40.01 102.87,40.01 95.89,46.99 94.3,46.99 93.03,48.26 U$2.013 | v128.27,37.47 128.91,36.83 140.34,36.83 141.6,35.56 R2.1 | v147,36.51 147,38.73 147.64,39.37 147.96,39.69 147.96,42.23 148.91,43.18 SV1.1
  Bottom 0.254: v125.73,40.01 v128.27,37.47 | v147,36.51 146.05,35.56 R2.1
N$1
  Bottom 0.813: R1.2 D1.A
N$2
  Bottom 0.406: PE.3 26.68,19.06 26.67,19.05 26.68,19.04 PE.2 PE.1 | PE.1 | PE.1
N$3  (via drill 4.06 pad 8)
  Bottom 0.813: R1.1 X1.1 3.17,50.8 1.91,49.53 1.91,8.89 3.79,7 v5,7
N$4
  Bottom 0.813: U$1.22 U$1.23 7.62,81.28 15.24,73.66 C11.2 | C2.+ C11.2 | C11.2 29.21,62.87 30.48,61.59 D1.C D2.C
N$5  (via drill 0.61)
  Top 0.254: S2.1 S2.2 | v145.73,41.59 145.73,44.13 144.78,45.09 R2.2
  Bottom 0.254: R5.1 C7.2 R2.2 147,45.72 147.96,46.67 147.96,60.33 149.86,62.23 S2.1 | R3.1 145.73,39.69 v145.73,41.59
N$6
  Bottom 0.406: PE.9 29.22,17.79 29.21,17.78 29.22,17.77 PE.8 29.22,15.25 | PE.7 29.22,15.25 | 29.22,15.25 29.21,15.24
N$7  (via drill 4.06 pad 8)
  other vias: 11,93
  pour Bottom (isolate 0.61): 1.91,42.55 1.91,99.69 16.51,99.69 16.51,76.2 17.78,74.93 17.78,64.45 34.92,64.45 34.92,42.55
  pour Top (isolate 0.61): 0.64,99.69 0.64,40.64 34.92,40.64 34.92,64.45 17.78,64.45 17.78,74.93 16.51,76.2 16.51,99.69
N$8
  Top 0.254: PE.14 34.03,18.04 35.56,16.51 R6.1
N$9
  Bottom 0.254: PE.15 31.76,24.12 32.38,23.5 34.92,23.5 35.56,22.86 R7.2
N$12
  Top 0.813: LED1.A 35.56,92.71 34.29,93.98 R8.1
N$13
  Top 0.813: LED2.A 44.45,38.73 45.72,37.47 R9.1
N$14
  Top 0.406: R10.1 44.45,31.75 30.48,31.75 29.21,30.48 29.21,27.94 29.22,27.93 PE.12
  Top 0.813: PE.12 29.22,27.63 29.21,27.62 28.26,28.57 19.05,28.57 17.78,29.84 C8.2 L1.2
  Bottom 0.813: R10.1 R11.1
N$15
  Top 0.406: PE.6 27.94,25.4 27.94,12.7 29.21,11.43 44.45,11.43 R12.1
  Top 0.813: C1.2 17.78,25.4 19.05,26.67 PE.6
  Bottom 0.813: R12.1 R13.1
PE
  pour Bottom (isolate 0.61): 1.91,0.64 1.91,38.73 34.29,38.73 34.29,0.64
  pour Top (isolate 0.61): 0.64,0.64 15.24,0.64 15.24,38.73 0.64,38.73
PORTA0  (via drill 0.61, 0.61 pad 0.61)
  Top 0.254: v102.87,22.86 109.22,22.86 109.86,23.5 | 109.86,23.5 110.49,24.13 110.49,26.67 109.22,27.94 U$2.035 109.22,29.21 | 109.86,23.5 v110.49,22.86 | v52.07,21.59 76.83,21.59 78.11,22.86 v79.38,22.86
  Bottom 0.254: v110.49,22.86 110.49,10.79 111.12,10.16 112.39,10.16 113.67,8.89 PORTA.3 | v79.38,22.86 v102.87,22.86 | R6.2 v52.07,21.59
PORTA1  (via drill 0.61, 0.61 pad 0.61)
  Top 0.254: v49.53,24.13 v80.01,24.13 | v101.92,24.13 108.58,24.13 109.22,24.77 U$2.034
  Bottom 0.254: PORTA.4 111.12,8.89 109.22,10.79 U$2.034 | v80.01,24.13 v101.92,24.13 | R7.1 v49.53,24.13
PORTA2  (via drill 0.61)
  Top 0.254: v107.95,12.7 112.39,12.7 113.67,11.43 PORTA.5
  Bottom 0.254: v107.95,12.7 107.95,27.3 106.68,28.57 U$2.033
PORTA3  (via drill 0.61)
  Top 0.254: v106.68,11.43 PORTA.6
  Bottom 0.254: v106.68,11.43 U$2.032
PORTA4
  Bottom 0.254: U$2.042 119.38,26.04 116.84,23.5 116.84,17.14 114.3,14.61 PORTA.7
PORTA5
  Bottom 0.254: PORTA.8 113.03,12.7 114.94,12.7 120.65,18.41 120.65,26.99 120.02,27.62 117.47,27.62 116.84,28.26 U$2.041
PORTB0  (via drill 0.61)
  Top 0.254: v127.64,53.34 124.46,53.34 123.19,52.07 91.44,52.07 90.81,52.7 90.81,57.78 91.44,58.42 U$2.05 | v127.64,57.15 v131.44,57.15 | v139.06,61.91 139.06,64.14 139.7,64.77 v141.29,64.77
  Bottom 0.254: v127.64,53.34 v127.64,57.15 | v131.44,57.15 137.16,57.15 137.79,57.78 137.79,61.59 138.11,61.91 v139.06,61.91 | v141.29,64.77 141.29,81.6 140.34,82.55 140.34,88.9 142.24,90.81 PORTB.3
PORTB1  (via drill 0.61)
  Top 0.254: v88.27,71.75 88.27,78.74 87.63,79.38 v87.63,81.28 | v107.31,82.55 121.92,82.55 v123.19,83.82 | v124.46,86.36 125.73,87.63 139.06,87.63 141.6,90.17 142.88,90.17 144.15,91.44 PORTB.4
  Bottom 0.254: v88.27,71.75 88.27,70.48 89.53,69.22 89.53,57.78 90.17,57.15 93.66,57.15 94.93,58.42 U$2.06 | v87.63,81.28 92.71,86.36 92.71,91.76 93.66,92.71 102.87,92.71 106.05,89.53 106.05,83.82 v107.31,82.55 | v123.19,83.82 123.19,85.72 123.83,86.36 v124.46,86.36
PORTB2  (via drill 0.61)
  Top 0.254: v107.31,57.15 93.98,57.15 92.71,55.88 U$2.07 | v116.2,48.26 v131.76,48.26 | v139.06,50.8 v143.19,50.8 | v145.73,54.61 v142.88,54.61
  Bottom 0.254: v107.31,57.15 v116.2,48.26 | v131.76,48.26 131.76,48.9 132.4,49.53 138.43,49.53 139.06,50.16 v139.06,50.8 | v143.19,50.8 143.19,51.75 143.83,52.39 145.1,52.39 145.73,53.02 v145.73,54.61 | v142.88,54.61 142.24,55.24 142.24,81.92 140.97,83.19 140.97,87 142.24,88.27 PORTB.5
PORTB3  (via drill 0.61)
  Top 0.254: v125.09,52.07 134.3,52.07 134.94,52.7 134.94,53.98 135.57,54.61 v139.06,54.61 | v139.06,60.64 141.6,60.64 142.88,61.91 142.88,64.14 143.51,64.77 v145.41,64.77 | U$2.08 v121.28,55.88
  Bottom 0.254: v121.28,55.88 v125.09,52.07 | v139.06,54.61 v139.06,60.64 | v145.41,64.77 145.41,65.41 144.78,66.04 144.78,81.92 146.05,83.19 146.05,87 144.78,88.27 PORTB.6
PORTB4  (via drill 0.61)
  Top 0.254: U$2.069 v143.51,55.88
  Bottom 0.254: v143.51,55.88 142.88,56.52 142.88,82.55 143.51,83.19 143.51,84.45 142.24,85.72 PORTB.7
PORTB5  (via drill 0.61)
  Top 0.254: v137.79,52.07 v148.91,52.07 | v151.13,66.04 151.13,67.31 151.76,67.94 151.76,73.66 151.13,74.3 141.29,74.3 140.34,75.25 140.34,84.45 140.97,85.09 142.88,85.09 144.15,86.36 PORTB.8
  Bottom 0.254: v137.79,52.07 137.79,54.29 137.48,54.61 135.57,54.61 134.3,53.34 U$2.068 | v148.91,52.07 148.91,59.69 151.76,62.55 151.76,64.77 151.13,65.41 v151.13,66.04
PORTB6
  Top 0.254: U$2.067 SV1.5 156.21,53.34 156.84,53.98 156.84,57.47 156.21,58.1 153.67,58.1 152.4,59.37 152.4,74.3 151.45,75.25 143.19,75.25 142.24,76.2 PORTB.9
PORTB7  (via drill 0.61)
  Top 0.254: v141.6,38.1 145.1,38.1 147.32,40.32 147.32,49.21 148.91,50.8 SV1.4 | v144.15,63.5 144.78,62.87 147.32,62.87 v153.03,57.15
  Bottom 0.254: v141.6,38.1 141.6,40.01 140.97,40.64 U$2.057 | v144.15,63.5 144.15,82.55 144.78,83.19 PORTB.10 | SV1.4 153.35,50.8 153.03,51.12 v153.03,57.15
PORTC0  (via drill 0.61)
  Top 0.254: v121.92,19.05 122.56,18.41 v143.51,18.41
  Bottom 0.254: v143.51,18.41 143.51,10.79 144.78,9.53 PORTC.3 | v121.92,19.05 U$2.044
PORTC1  (via drill 0.61)
  Top 0.254: v138.43,25.4 131.44,32.38 120.02,32.38 119.38,31.75 U$2.043
  Bottom 0.254: v138.43,25.4 139.06,24.77 139.06,10.79 140.97,8.89 PORTC.4
PORTC2  (via drill 0.61)
  Top 0.254: U$2.053 140.34,35.56 141.6,34.29 144.78,34.29 146.05,33.02 v146.05,25.08
  Bottom 0.254: v146.05,25.08 146.05,13.34 144.78,12.06 PORTC.5
PORTC3
  Bottom 0.254: U$2.054 133.99,35.56 135.25,36.83 139.06,36.83 139.7,36.2 139.7,11.43 140.97,10.16 141.6,10.16 142.24,10.79 PORTC.6
PORTC4
  Top 0.254: U$2.055 136.53,38.1 137.16,37.47 140.97,37.47 141.6,36.83 145.41,36.83 146.05,36.2 146.05,35.56 147.64,33.97 147.64,15.24 146.37,13.97 PORTC.7
PORTC5  (via drill 0.61)
  Top 0.254: v132.72,13.97 PORTC.8
  Bottom 0.254: v132.72,13.97 132.72,27.94 132.08,28.57 132.08,37.47 132.72,38.1 U$2.056
PORTC6  (via drill 0.61)
  Top 0.254: v142.24,23.81 123.83,23.81 123.19,24.45 123.19,27.3 121.92,28.57 U$2.045
  Bottom 0.254: PORTC.9 144.78,21.27 v142.24,23.81
PORTC7  (via drill 0.61)
  Top 0.254: v124.46,22.23 v142.24,22.23
  Bottom 0.254: v124.46,22.23 U$2.046 | v142.24,22.23 PORTC.10
PORTD0  (via drill 0.61)
  Top 0.254: v119.38,80.64 119.38,78.74 112.39,71.75 109.86,71.75 109.22,71.12 U$2.092 | v119.38,88.9 118.11,90.17 v113.03,90.17
  Bottom 0.254: v119.38,80.64 v119.38,88.9 | PORTD.3 112.39,91.44 113.03,90.81 v113.03,90.17
PORTD1  (via drill 0.61)
  Top 0.254: v108.27,75.56 104.46,79.38 v104.14,79.38 | v102.87,90.17 108.27,90.17 110.81,92.71 113.67,92.71 114.3,92.08 PORTD.4
  Bottom 0.254: v108.27,75.56 108.27,74.61 110.49,72.39 110.49,69.22 111.76,67.94 U$2.091 | v104.14,79.38 102.87,80.64 v102.87,90.17
PORTD2  (via drill 0.61)
  Top 0.254: v113.35,75.88 v113.35,79.38
  Bottom 0.254: v113.35,75.88 111.76,74.3 U$2.090 | v113.35,79.38 110.49,82.23 110.49,87 111.76,88.27 PORTD.5
PORTD3  (via drill 0.61)
  Top 0.254: v113.03,73.98 112.08,73.98 110.49,75.56 110.49,80.01 111.12,80.64 114.94,80.64 v115.25,80.96
  Bottom 0.254: v113.03,73.98 113.03,69.22 114.3,67.94 U$2.089 | v115.25,80.96 115.57,81.28 115.57,87 114.3,88.27 PORTD.6
PORTD4  (via drill 0.61)
  Top 0.254: v114.94,75.88 v114.94,79.38
  Bottom 0.254: v114.94,79.38 113.03,81.28 113.03,84.45 111.76,85.72 PORTD.7 | U$2.088 114.3,73.66 114.94,74.3 v114.94,75.88
PORTD5  (via drill 0.61)
  Top 0.254: v118.43,86.36 PORTD.8 | v120.97,76.52 120.97,73.98 118.11,71.12 118.11,69.22 116.84,67.94 U$2.087
  Bottom 0.254: v120.97,76.52 118.43,79.06 v118.43,86.36
PORTD6  (via drill 0.61)
  Top 0.254: v106.68,75.56 102.87,79.38 102.87,83.19 103.5,83.82 PORTD.9
  Bottom 0.254: v106.68,75.56 106.68,74.93 107.95,73.66 107.95,69.22 108.27,68.9 109.86,68.9 110.49,68.26 110.49,66.67 111.12,66.04 117.47,66.04 118.11,66.67 118.11,68.58 119.38,69.85 U$2.084
PORTD7  (via drill 0.61)
  Top 0.254: v120.33,83.82 PORTD.10 | v123.19,76.52 123.19,68.58 121.92,67.31 U$2.083
  Bottom 0.254: v123.19,76.52 120.33,79.38 v120.33,83.82
PORTE0  (via drill 0.61)
  Top 0.254: v89.53,70.48 89.53,80.01 90.17,80.64 v93.34,80.64
  Bottom 0.254: v93.34,80.64 93.66,80.96 93.66,89.22 95.89,91.44 PORTE.3 | v89.53,70.48 90.49,69.53 90.49,60.64 91.44,59.69 93.66,59.69 94.93,60.96 U$2.04
PORTE1  (via drill 0.61)
  Top 0.254: v88.27,68.58 88.9,69.22 93.34,69.22 v96.84,72.71 | v99.38,75.25 v94.61,80.01 | v88.27,60.96 U$2.03
  Bottom 0.254: v88.27,60.96 v88.27,68.58 | v96.84,72.71 v99.38,75.25 | v94.61,80.01 94.61,88.9 95.89,90.17 98.42,90.17 99.06,90.81 PORTE.4
PORTE2  (via drill 0.61)
  Top 0.254: v102.87,74.3 102.87,75.56 99.69,78.74 99.06,78.74 v97.79,80.01
  Bottom 0.254: v97.79,80.01 95.25,82.55 95.25,87 96.52,88.27 PORTE.5 | U$2.098 101.6,73.66 102.23,74.3 v102.87,74.3
PORTE3  (via drill 0.61)
  Top 0.254: v102.87,72.39 99.69,72.39 v92.71,79.38 | v91.44,83.82 91.44,89.53 92.08,90.17 98.74,90.17 99.06,89.85 PORTE.6
  Bottom 0.254: v102.87,72.39 102.87,69.22 104.14,67.94 U$2.097 | v92.71,79.38 91.44,80.64 v91.44,83.82
PORTE4  (via drill 0.61)
  Top 0.254: v104.14,75.56 99.69,80.01 v99.38,80.01
  Bottom 0.254: v99.38,80.01 97.79,81.6 97.79,84.45 96.52,85.72 PORTE.7 | U$2.096 v104.14,75.56
PORTE5  (via drill 0.61)
  Top 0.254: v111.76,75.88 v111.76,79.38 | v108.58,86.36 PORTE.8 | v105.41,71.12 106.05,71.75 107.63,71.75 110.17,74.3 v110.49,74.3
  Bottom 0.254: v105.41,71.12 105.41,69.22 106.68,67.94 U$2.095 | v110.49,74.3 110.49,74.61 v111.76,75.88 | v111.76,79.38 108.58,82.55 v108.58,86.36
PORTE6  (via drill 0.61)
  Top 0.254: v106.68,73.03 107.63,73.03 109.22,74.61 109.22,76.2 105.41,80.01 v105.41,80.33 | v97.79,87.63 97.79,85.41 97.47,85.09 96.84,85.09 96.52,84.77 PORTE.9
  Bottom 0.254: v105.41,80.33 105.41,89.22 103.19,91.44 100.65,91.44 100.33,91.12 100.33,88.27 99.69,87.63 v97.79,87.63 | U$2.094 v106.68,73.03
PORTE7  (via drill 0.61)
  Top 0.254: v94.61,75.56 v90.81,79.38 | v89.22,81.28 89.85,81.92 97.79,81.92 99.06,83.19 PORTE.10
  Bottom 0.254: v94.61,75.56 94.61,69.85 98.42,66.04 108.58,66.04 109.22,66.67 U$2.093 | v90.81,79.38 89.22,80.96 v89.22,81.28
PORTF0  (via drill 0.61)
  Top 0.254: v102.23,37.47 125.73,37.47 128.91,34.29 v138.43,34.29 | v137.16,17.14 136.53,17.78 114.94,17.78 113.03,19.68 102.23,19.68 100.97,18.41 v93.98,18.41 | U$2.012 95.89,50.8 v102.23,44.45
  Bottom 0.254: v102.23,37.47 v102.23,44.45 | v137.16,17.14 137.16,26.67 138.43,27.94 v138.43,34.29 | v93.98,18.41 84.45,8.89 PORTF.3
PORTF1  (via drill 0.61)
  Top 0.254: v95.89,25.4 85.72,15.24 v85.72,12.7
  Bottom 0.254: v95.89,25.4 96.2,25.08 100.97,25.08 101.6,25.72 U$2.028 | v85.72,12.7 83.19,12.7 82.55,12.06 82.55,10.79 81.28,9.53 PORTF.4
PORTF2  (via drill 0.61)
  Top 0.254: PORTF.5 83.82,12.06 82.55,13.34 82.55,18.41 83.5,19.37 85.72,19.37 93.03,26.67 v93.03,28.89
  Bottom 0.254: U$2.023 91.44,35.56 90.81,34.92 90.81,29.21 91.12,28.89 v93.03,28.89
PORTF3  (via drill 0.61)
  Top 0.254: v93.66,30.8 92.71,29.84 88.27,29.84 87,28.57 87,27.62 81.28,21.91 v81.28,21.59
  Bottom 0.254: v81.28,21.59 80.01,20.32 80.01,12.06 80.64,11.43 PORTF.6 | U$2.022 94.61,38.1 93.66,37.15 v93.66,30.8
PORTF4  (via drill 0.61)
  Top 0.254: v85.41,21.59 v91.44,27.62
  Bottom 0.254: v85.41,21.59 85.41,14.61 84.77,13.97 PORTF.7 | U$2.021 90.81,38.1 90.17,37.47 90.17,28.89 v91.44,27.62
PORTF5  (via drill 0.61)
  Top 0.254: v87.63,30.8 87.63,30.48 86.04,28.89 86.04,27.94 80.01,21.91 80.01,15.88 81.28,14.61 PORTF.8 | U$2.020 95,40.39 93.98,39.37 v87.63,39.37
  Bottom 0.254: v87.63,30.8 v87.63,39.37
PORTF6  (via drill 0.61)
  Top 0.254: v83.82,21.59 v89.85,27.62
  Bottom 0.254: PORTF.9 v83.82,21.59 | U$2.019 90.17,40.64 89.53,40.01 89.53,27.94 v89.85,27.62
PORTF7  (via drill 0.61)
  Top 0.254: v82.23,20.64 82.23,21.27 88.27,27.3 v88.27,27.62
  Bottom 0.254: PORTF.10 81.28,19.68 v82.23,20.64 | v88.27,27.62 88.27,28.26 88.9,28.89 88.9,40.64 90.17,41.91 93.66,41.91 94.93,43.18 U$2.018
PORTG0  (via drill 0.61)
  Top 0.254: v144.78,58.42 U$2.071 | v142.88,45.09 142.88,42.55 144.15,41.27 144.15,40.01 143.51,39.37 132.08,39.37 131.44,38.73 100.97,38.73 99.69,37.47 v99.69,31.11 | v93.66,21.27 97.47,25.08 v97.47,26.67
  Bottom 0.254: v144.78,58.42 144.78,55.24 144.15,54.61 144.15,53.98 142.24,52.07 142.24,45.72 v142.88,45.09 | v99.69,31.11 98.11,31.11 97.47,30.48 v97.47,26.67 | v93.66,21.27 95.25,19.68 95.25,10.79 95.89,10.16 97.79,10.16 PORTG.3
PORTG1  (via drill 0.61)
  Top 0.254: v126.36,45.09 126.36,41.91 127,41.27 v127.95,41.27 | v140.97,12.7 139.06,12.7 136.53,10.16 98.42,10.16 97.16,8.89 PORTG.4 | v126.36,55.88 U$2.070
  Bottom 0.254: v126.36,45.09 v126.36,55.88 | v140.97,12.7 140.97,36.2 140.34,36.83 140.34,38.73 139.7,39.37 132.72,39.37 132.08,40.01 132.08,40.64 131.44,41.27 v127.95,41.27
PORTG2  (via drill 0.61)
  Top 0.254: v100.97,20.32 124.14,20.32 124.78,19.68 v134.62,19.68
  Bottom 0.254: v100.97,20.32 100.33,19.68 100.33,13.34 99.06,12.06 PORTG.5 | U$2.052 133.99,33.02 134.62,32.38 v134.62,19.68
PORTG3
  Top 0.254: U$2.051 136.53,33.02 146.69,22.86 146.69,15.88 146.05,15.24 132.08,15.24 131.44,14.61 131.44,13.97 130.18,12.7 117.47,12.7 114.94,15.24 102.23,15.24 99.69,12.7 98.42,12.7 97.16,11.43 PORTG.6
PORTG4  (via drill 0.61)
  Top 0.254: v109.22,41.27 102.87,41.27 95.89,48.26 U$2.014 | v120.65,30.48 120.65,22.23 120.02,21.59 v100.01,21.59
  Bottom 0.254: v100.01,21.59 97.79,19.37 97.79,15.88 99.06,14.61 PORTG.7 | v109.22,41.27 118.43,41.27 120.65,39.05 v120.65,30.48
PORTG5  (via drill 0.61)
  Top 0.254: v80.33,10.16 92.08,10.16 95.89,13.97 PORTG.8 | v76.2,50.8 U$2.011
  Bottom 0.254: v76.2,50.8 76.2,11.11 77.15,10.16 v80.33,10.16
PORTG6  (via drill 0.61)
  Top 0.254: v100.97,34.92 100.97,30.48 100.33,29.84 100.33,25.4 94.61,19.68 93.34,19.68 92.71,19.05 92.71,15.88 93.34,15.24 97.16,15.24 98.42,16.51 PORTG.9 | v98.42,53.34 U$2.010
  Bottom 0.254: v98.42,53.34 100.97,50.8 v100.97,34.92
PORTG7  (via drill 0.61)
  Top 0.254: v111.76,18.41 111.12,17.78 98.42,17.78 97.16,16.51 PORTG.10
  Bottom 0.254: v111.76,18.41 111.76,23.5 114.3,26.04 U$2.038
PORTH0  (via drill 0.61)
  Top 0.254: v124.46,81.28 123.19,81.28 115.57,73.66 115.57,69.22 115.25,68.9 102.23,68.9 101.6,68.26 U$2.099
  Bottom 0.254: v124.46,81.28 125.73,82.55 125.73,89.53 127,90.81 PORTH.3
PORTH1  (via drill 0.61)
  Top 0.254: v101.6,75.56 99.69,77.47 98.42,77.47 95.89,80.01 95.89,80.96 96.2,81.28 v100.01,81.28 | v100.97,87.63 123.83,87.63 126.36,90.17 127.64,90.17 128.91,91.44 PORTH.4
  Bottom 0.254: v101.6,75.56 100.33,74.3 100.33,71.75 99.06,70.48 U$2.0100 | v100.01,81.28 100.97,82.23 v100.97,87.63
PORTH2  (via drill 0.61)
  Top 0.254: v96.2,54.61 134.3,54.61 134.94,55.24 134.94,59.05 135.57,59.69 137.48,59.69 137.79,60.01 137.79,67.31 137.16,67.94 134.94,67.94 133.99,68.9 v133.99,81.28
  Bottom 0.254: v96.2,54.61 96.52,54.93 96.52,61.59 95.89,62.23 93.98,62.23 92.71,63.5 U$2.01 | v133.99,81.28 130.18,85.09 128.91,85.09 128.27,85.72 128.27,87 127,88.27 PORTH.5
PORTH3  (via drill 0.61)
  Top 0.254: v132.72,85.09 132.72,67.31 128.91,63.5 U$2.02
  Bottom 0.254: v132.72,85.09 129.54,88.27 PORTH.6
PORTH4  (via drill 0.61)
  Top 0.254: v98.42,60.96 v126.36,60.96 | v131.44,73.03 v131.44,78.74 | U$2.027 99.06,29.84 98.42,30.48 v98.42,37.47
  Bottom 0.254: v98.42,37.47 97.16,38.73 97.16,53.66 98.42,54.93 v98.42,60.96 | v126.36,60.96 131.44,66.04 v131.44,73.03 | v131.44,78.74 128.27,81.92 128.27,84.45 127,85.72 PORTH.7
PORTH5  (via drill 0.61)
  Top 0.254: v87,48.26 87,42.55 86.36,41.91 86.36,36.83 88.9,34.29 93.03,34.29 93.66,33.66 93.66,32.38 99.06,26.99 U$2.026 99.06,26.35 | v87,67.31 94.3,67.31 98.42,71.44 104.14,71.44 105.41,72.71 105.41,75.56 v101.6,79.38 | v101.28,89.22 101.6,88.9 v107.31,88.9 | v107.31,85.09 127.64,85.09 128.91,86.36 PORTH.8
  Bottom 0.254: v87,48.26 v87,67.31 | v101.6,79.38 102.23,80.01 102.23,88.27 v101.28,89.22 | v107.31,88.9 v107.31,85.09
PORTH6  (via drill 0.61)
  Top 0.254: v79.38,45.09 79.38,34.29 80.64,33.02 U$2.025 | v79.38,73.66 79.38,74.93 80.01,75.56 86.36,75.56 87.63,76.83 87.63,78.11 86.36,79.38 86.36,81.92 87,82.55 97.16,82.55 97.79,83.19 97.79,84.45 98.42,85.09 v104.14,85.09 | v104.14,82.55 105.41,81.28 113.98,81.28 114.62,81.92 122.87,81.92 124.78,83.82 PORTH.9
  Bottom 0.254: v79.38,45.09 v79.38,73.66 | v104.14,85.09 v104.14,82.55
PORTH7  (via drill 0.61)
  Top 0.254: v99.69,48.9 101.6,46.99 v146.05,46.99 | v147.96,63.5 147.96,65.41 148.59,66.04 148.59,68.58 147.96,69.22 147.96,72.71 147.32,73.34 137.48,73.34 135.57,75.25 135.57,85.09 133.99,86.68 132.4,86.68 PORTH.10
  Bottom 0.254: v99.69,48.9 99.69,36.2 99.06,35.56 U$2.024 | v146.05,46.99 147.32,48.26 147.32,62.87 v147.96,63.5
PORTJ0  (via drill 0.61)
  Top 0.254: U$2.049 127,28.26 127.64,27.62 v131.44,27.62
  Bottom 0.254: v131.44,27.62 131.44,11.43 129.54,9.53 PORTJ.3
PORTJ1  (via drill 0.61)
  Top 0.254: U$2.0{ 129.54,25.4 128.91,24.77 v125.73,24.77
  Bottom 0.254: v125.73,24.77 125.73,18.41 125.09,17.78 125.09,11.43 127,9.53 PORTJ.4
PORTJ2  (via drill 0.61)
  Top 0.254: v130.81,45.09 129.54,43.81 v129.54,40.01 | v129.54,31.11 132.08,28.57 v133.35,28.57 | v133.99,12.7 132.72,11.43 PORTJ.5
  Bottom 0.254: v130.81,45.09 130.81,50.16 131.44,50.8 U$2.066 | v129.54,31.11 v129.54,40.01 | v133.35,28.57 133.35,14.61 133.99,13.97 v133.99,12.7
PORTJ3  (via drill 0.61)
  Top 0.254: v142.88,40.64 137.79,45.72 U$2.061 | v143.51,24.45 143.51,21.59 142.88,20.95 v129.54,20.95
  Bottom 0.254: v142.88,40.64 143.51,40.01 v143.51,24.45 | v129.54,20.95 128.27,19.68 128.27,13.34 127,12.06 PORTJ.6
PORTJ4  (via drill 0.61)
  Top 0.254: v123.19,16.51 124.46,15.24 127.64,15.24 128.91,13.97 PORTJ.7
  Bottom 0.254: v123.19,16.51 123.19,27.3 124.46,28.57 U$2.047
PORTJ5
  Bottom 0.254: U$2.048 127,18.41 125.73,17.14 125.73,15.88 127,14.61 PORTJ.8
PORTJ6  (via drill 0.61)
  Top 0.254: U$2.058 131.76,40.64 v131.13,40.01
  Bottom 0.254: v131.13,40.01 130.81,39.69 130.81,28.57 130.18,27.94 130.18,27.3 130.81,26.67 130.81,18.41 129.54,17.14 PORTJ.9
PORTJ7  (via drill 0.61)
  Top 0.254: v125.73,33.97 115.57,33.97 114.3,32.7 U$2.039
  Bottom 0.254: v125.73,33.97 128.27,31.43 128.27,21.59 127.64,20.95 127.64,16.51 PORTJ.10
TPIN+
  Top 0.254: U$2.074 133.35,60.96 132.08,62.23 53.98,62.23 52.7,60.96 52.7,30.8 47.62,25.72 47.62,8.57 46.99,7.94 35.56,7.94 | PE.4 25.14,22.61 24.77,22.23 24.77,8.57 25.4,7.94 35.56,7.94 | 35.56,7.94 R12.2
TPIN-
  Top 0.254: PE.5 24.64,24.64 24.13,24.13 24.13,8.26 25.08,7.3 35.56,7.3 | U$2.073 135.89,60.96 134.62,59.69 53.98,59.69 53.34,59.05 53.34,30.48 48.26,25.4 48.26,8.26 47.31,7.3 35.56,7.3 | 35.56,7.3 R13.2
TPOUT+
  Top 0.254: U$2.078 127,69.85 128.27,68.58 128.27,66.67 127.64,66.04 77.47,66.04 76.2,67.31 52.07,67.31 50.8,66.04 50.8,31.75 46.99,27.94 37.47,27.94 35.56,27.94 | PE.11 29.22,25.73 29.84,26.35 33.97,26.35 35.56,27.94 | 35.56,27.94 35.56,29.84 R10.2
TPOUT-
  Top 0.254: U$2.077 129.54,66.04 128.27,64.77 52.7,64.77 51.44,63.5 51.44,31.43 47.31,27.3 37.47,27.3 R11.2 33.66,23.5 30.48,23.5 29.21,23.5 29.22,23.5 PE.10
VDD  (via drill 0.61, 0.61 pad 0.61, 0.61 pad 1.27)
  Top 0.254: v77.47,12.06 75.88,12.06 75.25,11.43 58.42,11.43 | 58.42,11.43 56.52,11.43 55.88,10.79 SV16.17 | 58.42,11.43 SV16.18
  Top 0.406: PORTA.1 113.03,7.62 104.78,7.62 v104.14,8.26
  Top 0.813: L1.1 35.56,35.56 36.83,36.83 36.83,44.45 38.1,45.72 R9.2 | SUPPLY.7 SUPPLY.9 v81.28,78.11 | PORTF.1 83.82,5.71 82.55,4.45 78.74,4.45 77.47,5.71 v77.47,12.06 | U$2.037 111.76,31.75 110.49,33.02 v102.23,33.02 | v81.28,78.11 80.64,78.11 | v81.28,78.11 v85.72,78.11 | R3.2 SV1.2
  Bottom 0.254: U$2.081 124.46,67.94 125.73,69.22 125.73,74.93
  Bottom 0.406: 101.85,28.96 104.14,26.67 | 104.14,26.67 U$2.030 | U$2.062 133.35,45.72 135.89,43.18 | 104.14,26.67 v104.14,8.26
  Bottom 0.813: PORTH.1 118.11,93.98 116.84,92.71 116.84,77.47 | 116.84,69.85 U$2.086 116.84,74.93 | 116.84,77.47 116.84,74.93 | 101.85,28.96 U$2.029 101.6,33.02 | 116.84,74.93 125.73,74.93 129.54,74.93 | 129.54,74.93 134.62,74.93 136.14,73.41 U$2.075 139.7,63.5 140.97,62.23 140.97,43.18 | v85.72,78.11 86.36,77.47 116.84,77.47 | U$2.059 135.89,43.18 140.97,43.18 | R3.2 149.86,44.45 148.59,43.18 140.97,43.18 | 101.6,33.02 98.42,33.02 95.25,29.84 95.25,27.94 93.03,25.72 83.82,25.72 | 101.6,33.02 v102.23,33.02 | v81.28,78.11 81.28,76.2 83.82,73.66 83.82,43.18 | 129.54,74.93 U$2.076 | 83.82,25.72 83.82,43.18 | 83.82,43.18 U$2.017 | v77.47,12.06 77.47,24.13 79.06,25.72 83.82,25.72
  pour Top (isolate 0.61): 78.74,88.27 36.83,88.27 36.83,40.64 49.53,40.64 49.53,78.11 81.28,78.11 81.28,86.36
VSS
  Bottom 0.254: PE.13 31.49,15.5 30.48,16.51 30.48,26.67 31.75,27.94 | U$2.040 116.84,26.67 115.89,27.62 115.57,27.62 | U$2.036 111.76,26.35 113.03,27.62 115.57,27.62 | U$2.031 104.14,29.84 105.41,31.11 114.3,31.11 115.57,29.84 115.57,27.62 | U$2.065 136.14,51.18 135.25,52.07 130.18,52.07 129.22,51.12 129.22,44.13 130.18,43.18 U$2.060 133.67,43.18
  Bottom 0.406: U$2.085 119.63,67.56 121.92,69.85 U$2.082 | 154.94,67.94 S2.3 157.8,63.5 | 154.94,67.94 S2.4 | R5.2 144.78,62.23 150.5,67.94 154.94,67.94 | SV1.3 C7.1 | 31.75,27.94 31.76,27.93 PE.16 | U$2.072 130.18,58.42 | 129.86,58.42 130.18,58.42 | 130.18,58.42 130.18,52.07
  Bottom 0.813: SUPPLY.10 SUPPLY.8 SUPPLY.6 SUPPLY.4 SUPPLY.2 83.82,97.79 99.06,97.79 | 144.78,97.79 147.32,97.79 147.96,97.16 147.96,87.63 148.59,87 157.48,87 157.8,86.36 157.8,63.5 158.12,48.26 | 144.78,97.79 129.54,97.79 | 129.54,97.79 114.3,97.79 | 114.3,97.79 99.06,97.79 | 158.12,48.26 158.12,13.97 157.48,13.34 148.59,13.34 147.96,12.7 147.96,2.54 147.32,1.91 142.24,1.91 | 127,1.91 142.24,1.91 | 111.76,1.91 127,1.91 | 96.52,1.91 111.76,1.91 | 96.52,1.91 82.55,1.91 81.28,3.17 PORTF.2 73.66,6.35 | 96.52,1.91 PORTG.2 | 111.76,1.91 PORTA.2 | 127,1.91 PORTJ.2 | 142.24,1.91 PORTC.2 | 144.78,97.79 PORTB.2 | 158.12,48.26 SV1.3 | 129.54,97.79 PORTH.2 | 114.3,97.79 PORTD.2 | 99.06,97.79 PORTE.2 | PE.16 36.57,27.68 39.37,30.48 LED2.K 37.47,40.64 -.2 | SV19.18 73.66,10.48 | 73.66,6.35 SV19.18 | SV19.18 SV19.17 | SV17.17 SV17.18 63.5,6.35 73.66,6.35
  Bottom 1.676: -.2 X1.3
  pour Bottom (isolate 0.61): 18.41,99.57 18.41,77.47 19.68,76.2 19.68,66.36 36.83,66.36 36.83,0.64 53.98,0.64 53.98,78.11 83.82,78.11 83.82,99.57
  pour Bottom (isolate 0.61): 159.38,99.69 159.38,0.64 53.98,0.64 53.98,8.26 75.56,8.26 75.56,99.69

### Text on the board
tNames: Design by JSIF | 5V | RESET | 9 - 30V= | 0V | PE | 3V3 | LAN | PIC18F97J60 IO BOARD | 20-02-2010